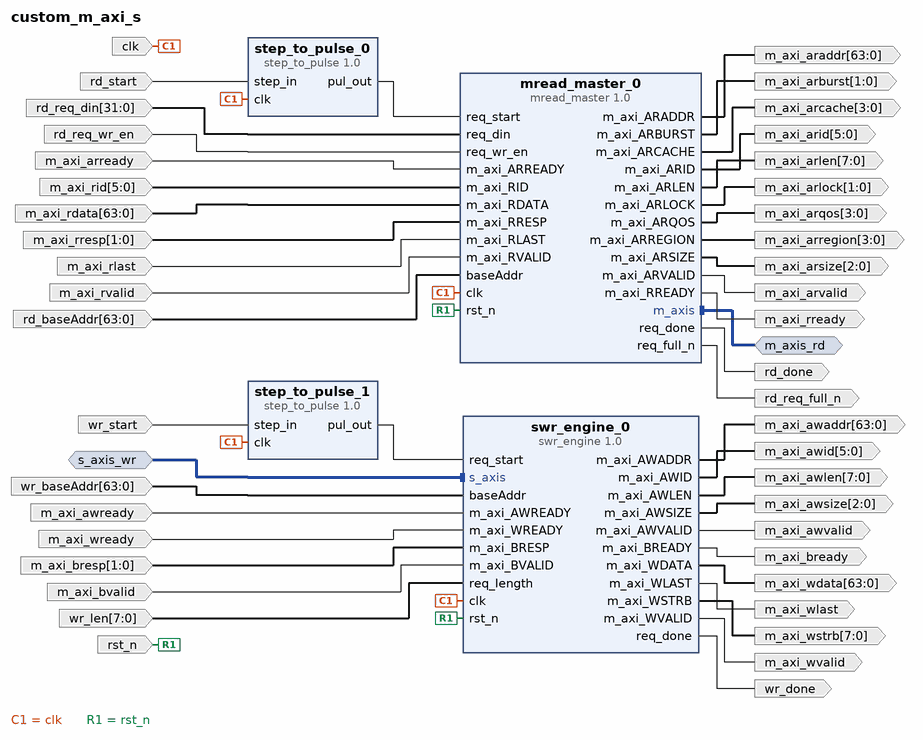
[diagram p0: block diagram of the top level]
# Vivado block design custom_m_axi_s, xcu280-fsvh2892-2L-e, Vivado 2020.2
create_bd_design custom_m_axi_s

create_bd_intf_port -mode Master -vlnv xilinx.com:interface:axis_rtl:1.0 m_axis_rd
create_bd_intf_port -mode Slave -vlnv xilinx.com:interface:axis_rtl:1.0 s_axis_wr
set_property -dict [list \
  CONFIG.HAS_TKEEP 0 \
  CONFIG.HAS_TLAST 0 \
  CONFIG.HAS_TREADY 1 \
  CONFIG.HAS_TSTRB 0 \
  CONFIG.LAYERED_METADATA undef \
  CONFIG.TDATA_NUM_BYTES 8 \
  CONFIG.TDEST_WIDTH 0 \
  CONFIG.TID_WIDTH 0 \
  CONFIG.TUSER_WIDTH 0 \
] [get_bd_intf_ports s_axis_wr]
create_bd_port -dir I -type clk clk
set_property -dict {CONFIG.ASSOCIATED_BUSIF m_axis_rd:s_axis_wr} [get_bd_ports clk]
create_bd_port -dir I -type rst rst_n
create_bd_port -dir I -from 63 -to 0 rd_baseAddr
create_bd_port -dir I rd_start
create_bd_port -dir I wr_start
create_bd_port -dir I -from 63 -to 0 wr_baseAddr
create_bd_port -dir I -from 7 -to 0 wr_len
create_bd_port -dir I -from 31 -to 0 rd_req_din
create_bd_port -dir I rd_req_wr_en
create_bd_port -dir O -from 5 -to 0 m_axi_arid
create_bd_port -dir O -from 63 -to 0 m_axi_araddr
create_bd_port -dir O -from 7 -to 0 m_axi_arlen
create_bd_port -dir O -from 2 -to 0 m_axi_arsize
create_bd_port -dir O -from 1 -to 0 m_axi_arburst
create_bd_port -dir O -from 1 -to 0 m_axi_arlock
create_bd_port -dir O -from 3 -to 0 m_axi_arcache
create_bd_port -dir O -from 3 -to 0 m_axi_arregion
create_bd_port -dir O -from 3 -to 0 m_axi_arqos
create_bd_port -dir O m_axi_arvalid
create_bd_port -dir I m_axi_arready
create_bd_port -dir I -from 5 -to 0 m_axi_rid
create_bd_port -dir I -from 1 -to 0 m_axi_rresp
create_bd_port -dir I m_axi_rlast
create_bd_port -dir I m_axi_rvalid
create_bd_port -dir O m_axi_rready
create_bd_port -dir O rd_req_full_n
create_bd_port -dir O rd_done
create_bd_port -dir O -from 5 -to 0 m_axi_awid
create_bd_port -dir O -from 63 -to 0 m_axi_awaddr
create_bd_port -dir O -from 7 -to 0 m_axi_awlen
create_bd_port -dir O -from 2 -to 0 m_axi_awsize
create_bd_port -dir O m_axi_awvalid
create_bd_port -dir I m_axi_awready
create_bd_port -dir O -from 7 -to 0 m_axi_wstrb
create_bd_port -dir O m_axi_wlast
create_bd_port -dir O m_axi_wvalid
create_bd_port -dir I m_axi_wready
create_bd_port -dir I -from 1 -to 0 m_axi_bresp
create_bd_port -dir I m_axi_bvalid
create_bd_port -dir O m_axi_bready
create_bd_port -dir O wr_done
create_bd_port -dir O -from 63 -to 0 m_axi_wdata
create_bd_port -dir I -from 63 -to 0 m_axi_rdata

create_bd_cell -type ip -vlnv user.org:user:step_to_pulse:1.0 step_to_pulse_0
create_bd_cell -type ip -vlnv user.org:user:step_to_pulse:1.0 step_to_pulse_1
create_bd_cell -type ip -vlnv user.org:user:mread_master:1.0 mread_master_0
set_property -dict {CONFIG.DATA_WIDTH 64} [get_bd_cells mread_master_0]
create_bd_cell -type ip -vlnv user.org:user:swr_engine:1.0 swr_engine_0
set_property -dict {CONFIG.DATA_WIDTH 64} [get_bd_cells swr_engine_0]

# ---- connections ----

connect_bd_intf_net [get_bd_intf_ports m_axis_rd] [get_bd_intf_pins mread_master_0/m_axis]
connect_bd_intf_net -intf_net s_axis_0_1 [get_bd_intf_ports s_axis_wr] [get_bd_intf_pins swr_engine_0/s_axis]
connect_bd_net -net clk_0_1 [get_bd_ports clk] \
  [get_bd_pins step_to_pulse_0/clk] [get_bd_pins step_to_pulse_1/clk] [get_bd_pins mread_master_0/clk] \
  [get_bd_pins swr_engine_0/clk]
connect_bd_net -net step_in_0_1 [get_bd_ports rd_start] [get_bd_pins step_to_pulse_0/step_in]
connect_bd_net -net step_in_0_2 [get_bd_ports wr_start] [get_bd_pins step_to_pulse_1/step_in]
connect_bd_net [get_bd_ports rst_n] [get_bd_pins mread_master_0/rst_n] [get_bd_pins swr_engine_0/rst_n]
connect_bd_net [get_bd_ports rd_req_din] [get_bd_pins mread_master_0/req_din]
connect_bd_net [get_bd_ports rd_req_wr_en] [get_bd_pins mread_master_0/req_wr_en]
connect_bd_net [get_bd_pins step_to_pulse_0/pul_out] [get_bd_pins mread_master_0/req_start]
connect_bd_net [get_bd_pins mread_master_0/m_axi_ARID] [get_bd_ports m_axi_arid]
connect_bd_net [get_bd_pins mread_master_0/m_axi_ARADDR] [get_bd_ports m_axi_araddr]
connect_bd_net [get_bd_pins mread_master_0/m_axi_ARLEN] [get_bd_ports m_axi_arlen]
connect_bd_net [get_bd_pins mread_master_0/m_axi_ARSIZE] [get_bd_ports m_axi_arsize]
connect_bd_net [get_bd_pins mread_master_0/m_axi_ARBURST] [get_bd_ports m_axi_arburst]
connect_bd_net [get_bd_pins mread_master_0/m_axi_ARLOCK] [get_bd_ports m_axi_arlock]
connect_bd_net [get_bd_pins mread_master_0/m_axi_ARCACHE] [get_bd_ports m_axi_arcache]
connect_bd_net [get_bd_pins mread_master_0/m_axi_ARREGION] [get_bd_ports m_axi_arregion]
connect_bd_net [get_bd_pins mread_master_0/m_axi_ARQOS] [get_bd_ports m_axi_arqos]
connect_bd_net [get_bd_pins mread_master_0/m_axi_ARVALID] [get_bd_ports m_axi_arvalid]
connect_bd_net [get_bd_ports m_axi_arready] [get_bd_pins mread_master_0/m_axi_ARREADY]
connect_bd_net [get_bd_ports m_axi_rid] [get_bd_pins mread_master_0/m_axi_RID]
connect_bd_net [get_bd_ports m_axi_rdata] [get_bd_pins mread_master_0/m_axi_RDATA]
connect_bd_net [get_bd_ports m_axi_rresp] [get_bd_pins mread_master_0/m_axi_RRESP]
connect_bd_net [get_bd_ports m_axi_rlast] [get_bd_pins mread_master_0/m_axi_RLAST]
connect_bd_net [get_bd_ports m_axi_rvalid] [get_bd_pins mread_master_0/m_axi_RVALID]
connect_bd_net [get_bd_pins mread_master_0/m_axi_RREADY] [get_bd_ports m_axi_rready]
connect_bd_net [get_bd_pins mread_master_0/req_full_n] [get_bd_ports rd_req_full_n]
connect_bd_net [get_bd_pins mread_master_0/req_done] [get_bd_ports rd_done]
connect_bd_net [get_bd_ports wr_baseAddr] [get_bd_pins swr_engine_0/baseAddr]
connect_bd_net [get_bd_ports rd_baseAddr] [get_bd_pins mread_master_0/baseAddr]
connect_bd_net [get_bd_pins swr_engine_0/m_axi_AWID] [get_bd_ports m_axi_awid]
connect_bd_net [get_bd_pins swr_engine_0/m_axi_AWADDR] [get_bd_ports m_axi_awaddr]
connect_bd_net [get_bd_pins swr_engine_0/m_axi_AWLEN] [get_bd_ports m_axi_awlen]
connect_bd_net [get_bd_pins swr_engine_0/m_axi_AWSIZE] [get_bd_ports m_axi_awsize]
connect_bd_net [get_bd_pins swr_engine_0/m_axi_AWVALID] [get_bd_ports m_axi_awvalid]
connect_bd_net [get_bd_ports m_axi_awready] [get_bd_pins swr_engine_0/m_axi_AWREADY]
connect_bd_net [get_bd_pins swr_engine_0/m_axi_WDATA] [get_bd_ports m_axi_wdata]
connect_bd_net [get_bd_pins swr_engine_0/m_axi_WSTRB] [get_bd_ports m_axi_wstrb]
connect_bd_net [get_bd_pins swr_engine_0/m_axi_WLAST] [get_bd_ports m_axi_wlast]
connect_bd_net [get_bd_pins swr_engine_0/m_axi_WVALID] [get_bd_ports m_axi_wvalid]
connect_bd_net [get_bd_ports m_axi_wready] [get_bd_pins swr_engine_0/m_axi_WREADY]
connect_bd_net [get_bd_ports m_axi_bresp] [get_bd_pins swr_engine_0/m_axi_BRESP]
connect_bd_net [get_bd_ports m_axi_bvalid] [get_bd_pins swr_engine_0/m_axi_BVALID]
connect_bd_net [get_bd_pins swr_engine_0/m_axi_BREADY] [get_bd_ports m_axi_bready]
connect_bd_net [get_bd_pins swr_engine_0/req_done] [get_bd_ports wr_done]
connect_bd_net [get_bd_pins step_to_pulse_1/pul_out] [get_bd_pins swr_engine_0/req_start]
connect_bd_net [get_bd_ports wr_len] [get_bd_pins swr_engine_0/req_length]

validate_bd_design
save_bd_design
